# EAGLE design avr (EAGLE 5.06)
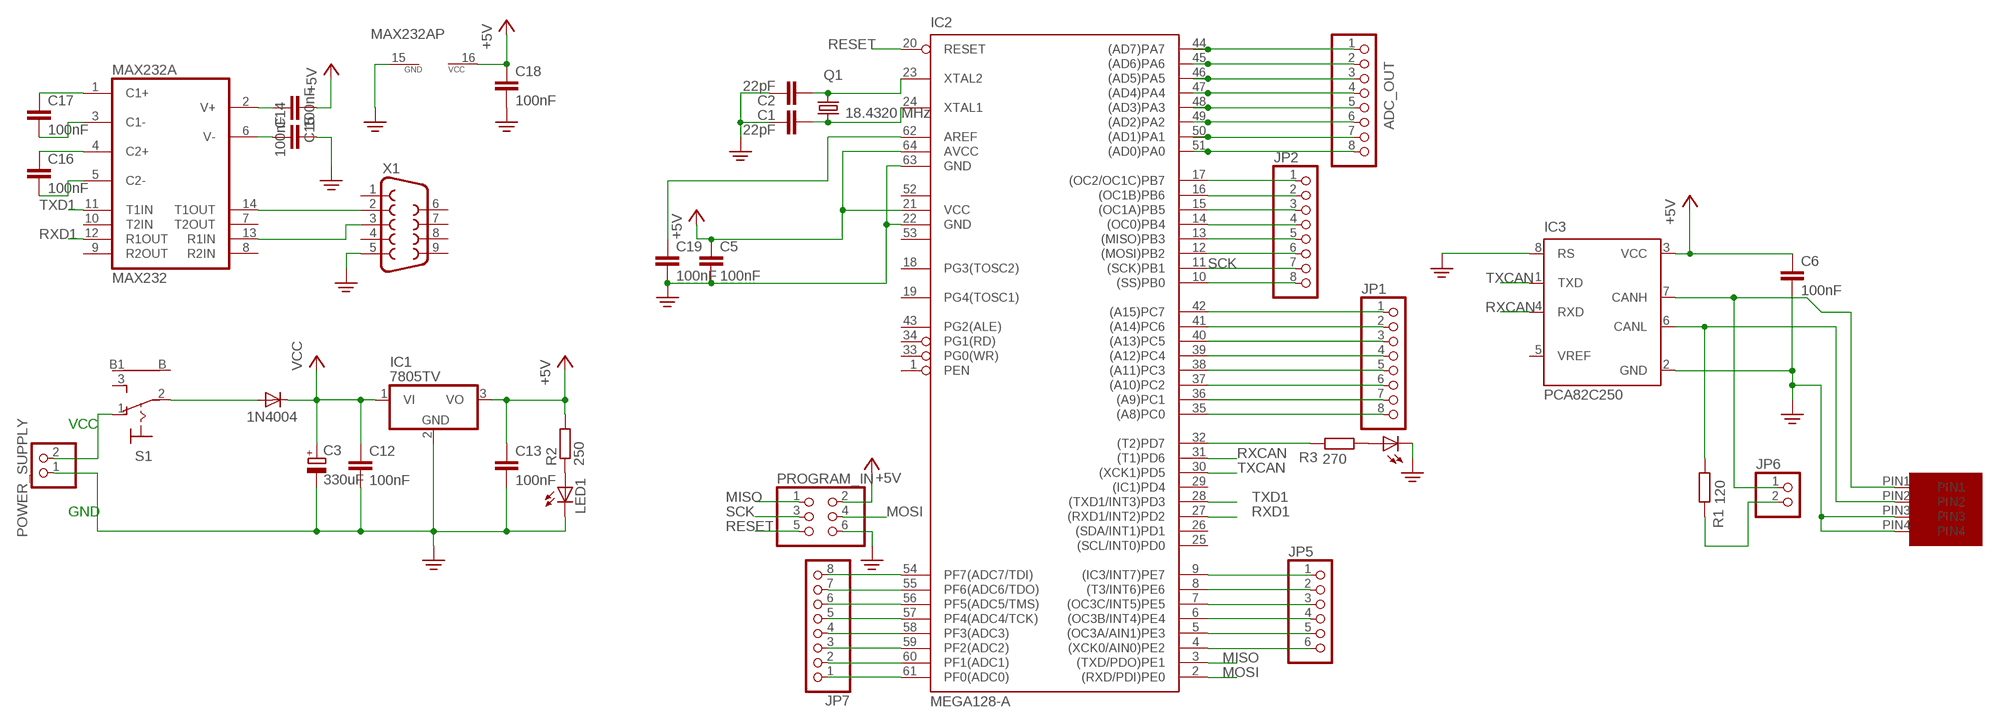
[diagram p0: schematic, sheet 1]

## Parts
ADC_OUT  PINHD-1X8  [1X08]
C1  22pF  C5/2.5  [C5B2.5]
C2  22pF  C5/2.5  [C5B2.5]
C3  330uF  CPOL-EUE15-5AXIAL  [E15-5]
C5  100nF  C-EU050-024X044  [C050-024X044]
C6  100nF  C-EU050-024X044  [C050-024X044]
C12  100nF  C-EU050-024X044  [C050-024X044]
C13  100nF  C-EU050-024X044  [C050-024X044]
C14  100nF  C-EU050-024X044  [C050-024X044]
C15  100nF  C-EU050-024X044  [C050-024X044]
C16  100nF  C-EU050-024X044  [C050-024X044]
C17  100nF  C-EU050-024X044  [C050-024X044]
C18  100nF  C-EU050-024X044  [C050-024X044]
C19  100nF  C-EU050-024X044  [C050-024X044]
D1  1N4004  [DO41-10]
IC1  7805TV  [TO220V]
IC2  MEGA128-A  [TQFP64]
IC3  PCA82C250  [DIL08]
JP1  PINHD-1X8  [1X08]
JP2  PINHD-1X8  [1X08]
JP5  PINHD-1X6  [1X06]
JP6  PINHD-1X2  [1X02]
JP7  PINHD-1X8  [1X08]
LED1  LED5MM  [LED5MM]
LED2  LED5MM  [LED5MM]
MAX232A  MAX232  [DIL16]
POWER_SUPPLY  PINHD-1X2  [1X02]
PROGRAM_IN  PINHD-2X3  [2X03]
Q1  18.4320 MHz  CRYSTALHC49U70  [HC49U70]
R1  120  R-EU_0207/10  [0207/10]
R2  250  R-EU_0207/10  [0207/10]
R3  270  R-EU_0207/10  [0207/10]
S1  LPV-1  [LPV-1]
U$1  MICROFIT4  [MICROFIT4SOCK]
X1  F09HP  [F09HP]

## Nets
+5V: C5.1 C6.1 C13.1 C15.1 C18.1 IC1.3(VO) IC2.21(VCC) IC2.64(AVCC) IC3.3(VCC) MAX232A.16(VCC) PROGRAM_IN.2 R2.2
MISO: IC2.3((TXD/PDO)PE1) PROGRAM_IN.1
MOSI: IC2.2((RXD/PDI)PE0) PROGRAM_IN.4
N$1: C1.2 IC2.24(XTAL1) Q1.1
N$2: C2.2 IC2.23(XTAL2) Q1.2
N$3: IC2.9((IC3/INT7)PE7) JP5.1
N$4: D1.A S1.2(P)
N$5: POWER_SUPPLY.2 S1.1(O)
N$6: LED1.A R2.1
N$7: IC2.35((A8)PC0) JP1.8
N$8: LED2.A R3.1
N$9: ADC_OUT.1 IC2.44((AD7)PA7)
N$10: C19.1 IC2.62(AREF)
N$11: ADC_OUT.2 IC2.45((AD6)PA6)
N$12: ADC_OUT.3 IC2.46((AD5)PA5)
N$13: ADC_OUT.4 IC2.47((AD4)PA4)
N$14: ADC_OUT.5 IC2.48((AD3)PA3)
N$15: ADC_OUT.6 IC2.49((AD2)PA2)
N$16: ADC_OUT.7 IC2.50((AD1)PA1)
N$17: ADC_OUT.8 IC2.51((AD0)PA0)
N$18: IC2.16((OC1B)PB6) JP2.2
N$19: IC2.17((OC2/OC1C)PB7) JP2.1
N$20: IC2.54(PF7(ADC7/TDI)) JP7.8
N$21: MAX232A.13(R1IN) X1.3
N$22: IC2.13((MISO)PB3) JP2.5
N$23: IC2.36((A9)PC1) JP1.7
N$24: IC2.37((A10)PC2) JP1.6
N$25: IC2.38((A11)PC3) JP1.5
N$26: IC2.39((A12)PC4) JP1.4
N$27: IC2.40((A13)PC5) JP1.3
N$28: IC2.41((A14)PC6) JP1.2
N$29: IC2.42((A15)PC7) JP1.1
N$30: IC2.8((T3/INT6)PE6) JP5.2
N$31: IC2.7((OC3C/INT5)PE5) JP5.3
N$32: IC2.6((OC3B/INT4)PE4) JP5.4
N$33: MAX232A.14(T1OUT) X1.2
N$34: IC2.5((OC3A/AIN1)PE3) JP5.5
N$35: C17.1 MAX232A.1(C1+)
N$36: C17.2 MAX232A.3(C1-)
N$37: C16.1 MAX232A.4(C2+)
N$38: C16.2 MAX232A.5(C2-)
N$39: C14.1 MAX232A.6(V-)
N$40: IC2.14((OC0)PB4) JP2.4
N$41: C15.2 MAX232A.2(V+)
N$42: IC2.4((XCK0/AIN0)PE2) JP5.6
N$43: IC2.32((T2)PD7) R3.2
N$44: IC2.55(PF6(ADC6/TDO)) JP7.7
N$45: IC2.10((SS)PB0) JP2.8
N$46: IC2.15((OC1A)PB5) JP2.3
N$47: IC2.12((MOSI)PB2) JP2.6
N$48: IC2.56(PF5(ADC5/TMS)) JP7.6
N$49: IC2.57(PF4(ADC4/TCK)) JP7.5
N$50: JP6.2 R1.2
N$51: IC3.6(CANL) R1.1 U$1.PIN2
N$52: IC3.7(CANH) JP6.1 U$1.PIN1
N$53: IC2.58(PF3(ADC3)) JP7.4
N$54: IC2.59(PF2(ADC2)) JP7.3
N$55: IC2.60(PF1(ADC1)) JP7.2
N$56: IC2.61(PF0(ADC0)) JP7.1
PE: C1.1 C2.1 C3.- C5.2 C6.2 C12.2 C13.2 C14.2 C18.2 C19.2 IC1.2(GND) IC2.22(GND) IC2.63(GND) IC3.2(GND) IC3.8(RS) LED1.K(C) LED2.K(C) MAX232A.15(GND) POWER_SUPPLY.1 PROGRAM_IN.6 U$1.PIN3 U$1.PIN4 X1.5
RESET: IC2.20(RESET) PROGRAM_IN.5
RXCAN: IC2.31((T1)PD6) IC3.4(RXD)
RXD1: IC2.27((RXD1/INT2)PD2) MAX232A.12(R1OUT)
SCK: IC2.11((SCK)PB1) JP2.7 PROGRAM_IN.3
TXCAN: IC2.30((XCK1)PD5) IC3.1(TXD)
TXD1: IC2.28((TXD1/INT3)PD3) MAX232A.11(T1IN)
VCC: C3.+ C12.1 D1.C IC1.1(VI)
Unconnected: IC2.1(PEN) IC2.18(PG3(TOSC2)) IC2.19(PG4(TOSC1)) IC2.25((SCL/INT0)PD0) IC2.26((SDA/INT1)PD1) IC2.29((IC1)PD4) IC2.33(PG0(WR)) IC2.34(PG1(RD)) IC2.43(PG2(ALE)) IC3.5(VREF) MAX232A.7(T2OUT) MAX232A.8(R2IN) MAX232A.9(R2OUT) MAX232A.10(T2IN) S1.3(S) S1.B S1.B1 X1.1 X1.4 X1.6 X1.7 X1.8 X1.9

## Notes on the sheet
- VCC
- GND

## Power pins joined to a net without a drawn wire
GND1: IC2.53(GND1)
VCC1: IC2.52(VCC1)

## Library data of the parts
ADC_OUT JP1 JP2 JP7 = pinhead:PINHD-1X8: PIN HEADER
C1 C2 = capacitor-wima:C: CAPACITOR naming: grid - package width
C3 = rcl:CPOL-EU: POLARIZED CAPACITOR, European symbol
C5 C6 C12-C19 = rcl:C-EU: CAPACITOR, European symbol
D1 = diode:1N4004: DIODE general purpose rectifier, 1 A
IC1 = linear:78*: Positive VOLTAGE REGULATOR Source: http://cache.national.com/ds/LM/LM78L05.pdf http://www.fairchildsemi.com/ds/LM/LM7805.pdf
IC2 = atmel:MEGA128: MICROCONTROLLER 128 Kbytes FLASH 4 Kbytes SRAM 4 Kbytes EEPROM DUAL USART 8-channel 10 bit ADC Source: avr.lbr
IC3 = micro-philips:PCA82C250: CAN CONTROLLER INTERFACE
JP5 = pinhead:PINHD-1X6: PIN HEADER
JP6 POWER_SUPPLY = pinhead:PINHD-1X2: PIN HEADER
LED1 LED2 = led:LED: LED OSRAM: - CHIPLED LG R971, LG N971, LY N971, LG Q971, LY Q971, LO R971, LY R971 LH N974, LH R974 LS Q976, LO Q976, LY Q976 LO Q996 - Hyper CHIPLED LW Q18S LB Q993, LB Q99A, LB R99A - SideLED LS A670, LO A670, LY A670, LG A670, LP A670 LB A673, LV A673, LT A673, LW A673 LH A674 LY A675 LS A676, LA A676, LO A676, LY A676, LW A676 LS A679, LY A679, LG A679 - Hyper Micro SIDELED® LS Y876, LA Y876, LO Y876, LY Y876 LT Y87S - SmartLED LW L88C, LW L88S LB L89C, LB L89S, LG L890 LS L89K, LO L89K, LY L89K LS L896, LA L896, LO L896, LY L896 - TOPLED LS T670, LO T670, LY T670, LG T670, LP T670 LSG T670, LSP T670, LSY T670, LOP T670, LYG T670 LG T671, LOG T671, LSG T671 LB T673, LV T673, LT T673, LW T673 LH T674 LS T676, LA T676, LO T676, LY T676, LB T676, LH T676, LSB T676, LW T676 LB T67C, LV T67C, LT T67C, LS T67K, LO T67K, LY T67K, LW E67C LS E67B, LA E67B, LO E67B, LY E67B, LB E67C, LV E67C, LT E67C LW T67C LS T679, LY T679, LG T679 LS T770, LO T770, LY T770, LG T770, LP T770 LB T773, LV T773, LT T773, LW T773 LH T774 LS E675, LA E675, LY E675, LS T675 LS T776, LA T776, LO T776, LY T776, LB T776 LHGB T686 LT T68C, LB T68C - Hyper Mini TOPLED® LB M676 - Mini TOPLED Santana® LG M470 LS M47K, LO M47K, LY M47K Source: http://www.osram.convergy.de LUXEON: - LUMILED® LXK2-PW12-R00, LXK2-PW12-S00, LXK2-PW14-U00, LXK2-PW14-V00 LXK2-PM12-R00, LXK2-PM12-S00, LXK2-PM14-U00 LXK2-PE12-Q00, LXK2-PE12-R00, LXK2-PE12-S00, LXK2-PE14-T00, LXK2-PE14-U00 LXK2-PB12-K00, LXK2-PB12-L00, LXK2-PB12-M00, LXK2-PB14-N00, LXK2-PB14-P00, LXK2-PB14-Q00 LXK2-PR12-L00, LXK2-PR12-M00, LXK2-PR14-Q00, LXK2-PR14-R00 LXK2-PD12-Q00, LXK2-PD12-R00, LXK2-PD12-S00 LXK2-PH12-R00, LXK2-PH12-S00 LXK2-PL12-P00, LXK2-PL12-Q00, LXK2-PL12-R00 Source: www.luxeon.com KINGBRIGHT: KA-3528ASYC Source: www.kingbright.com
MAX232A = maxim:MAX232: RS232 TRANSEIVER
PROGRAM_IN = pinhead:PINHD-2X3: PIN HEADER
Q1 = crystal:CRYSTAL: CRYSTAL
R1-R3 = resistor:R-EU_: RESISTOR, European symbol
S1 = switch:LPV-1: TOGGLE SWITCH
U$1 = UNICORN:MICROFIT4
X1 = con-subd:F09: SUB-D

## Board
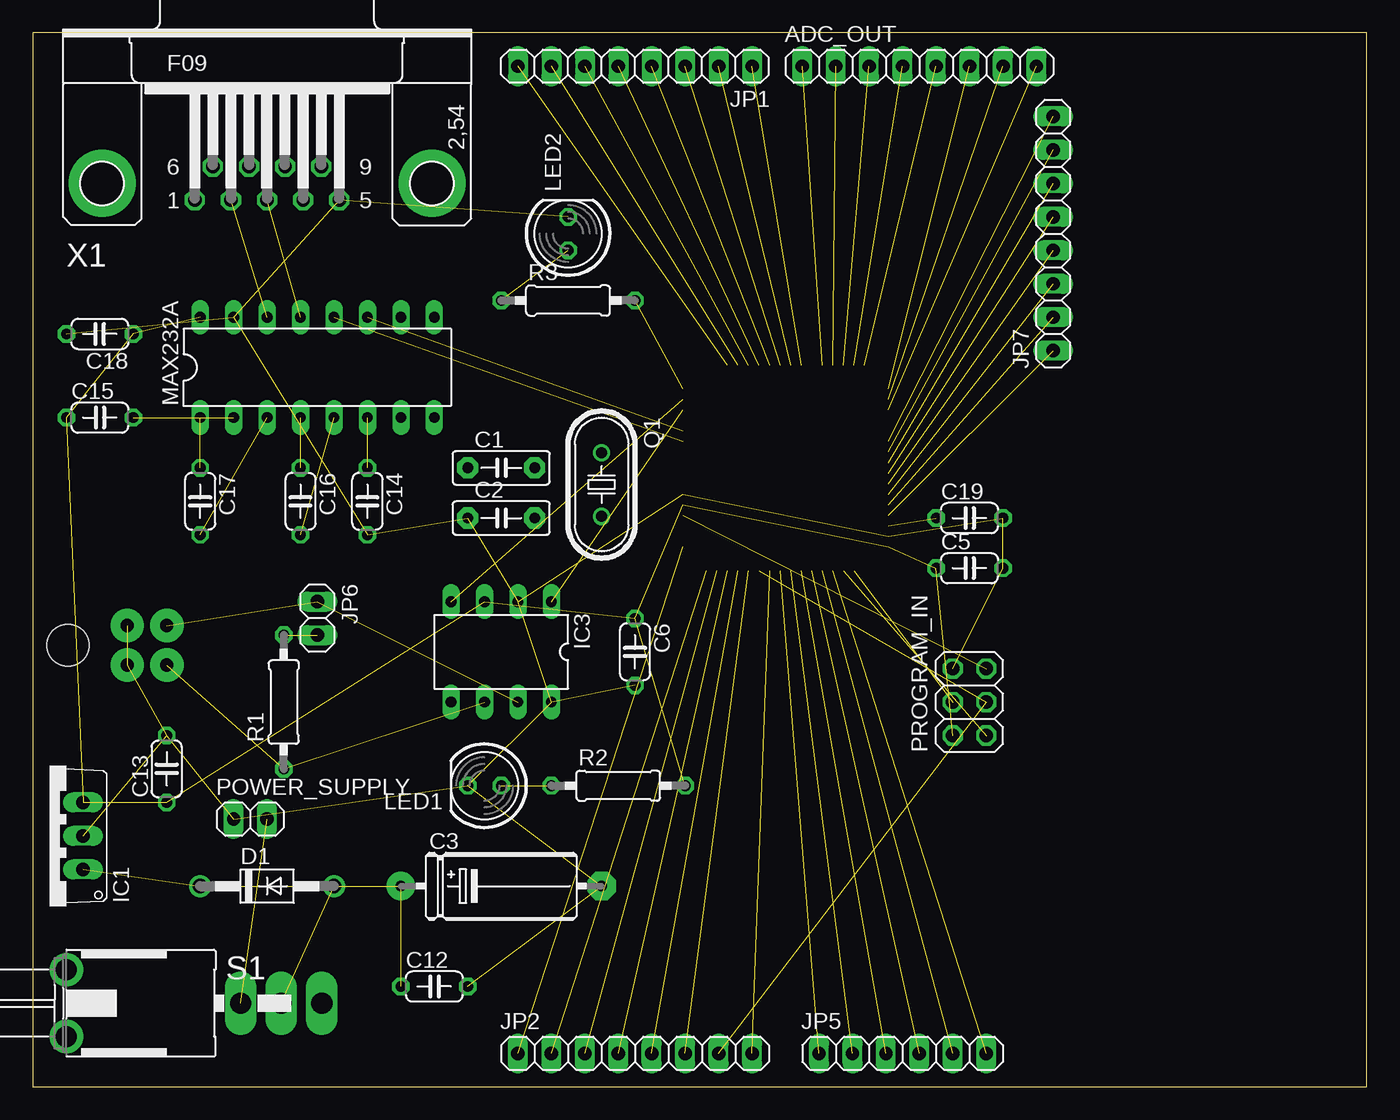
[diagram p1: board, top side]
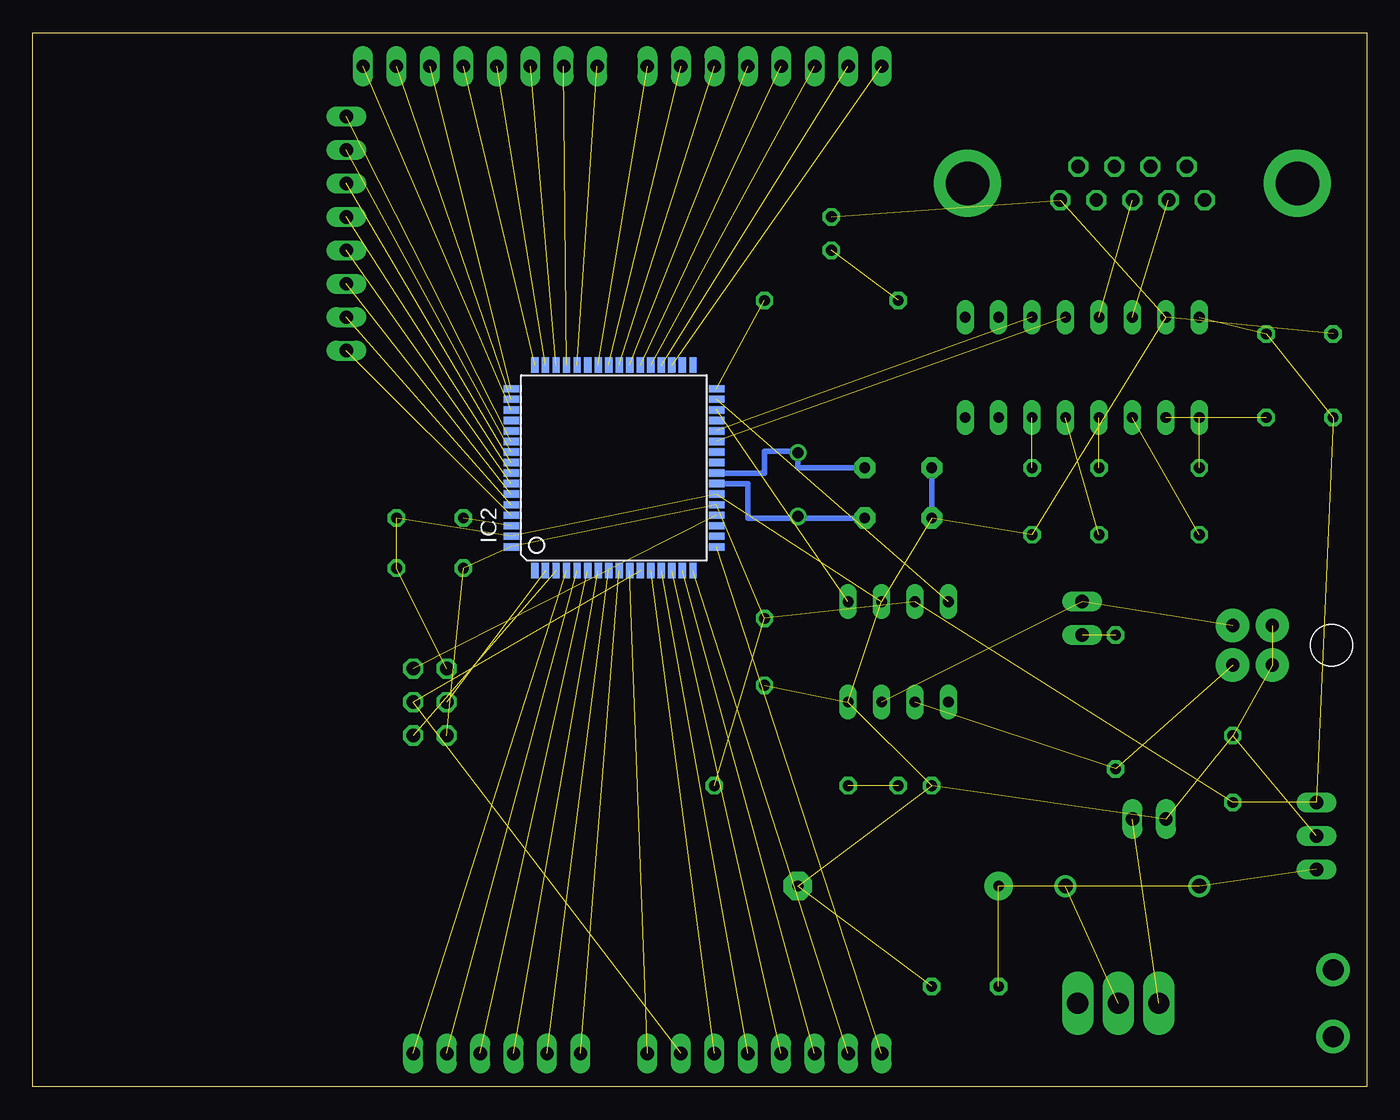
[diagram p2: board, bottom side, seen from below]

Size 101.27 x 80 mm. Coordinates in mm from the lower left corner, seen from the top.
Outline: 0,0 101.27,0 101.27,80 0,80 0,0
Copper layers (1*16): Top 0.035mm / dielectric 1.5mm / Bottom 0.035mm
Design rules "default": minimum track width 10mil, minimum drill 24mil, track to track 8mil, track to pad 8mil, pad to pad 8mil, via to via 8mil, smd to smd 8mil, copper to edge 40mil, drill to drill 8mil, minimum pad ring 10mil, minimum via ring 8mil, stop-mask expansion 4mil, vias tented up to drill 0mil, thermal gap 10mil
tRestrict: area 1.3,55.9 to 3.8,58.4; area 6.3,55.9 to 8.9,58.4; area 1.3,49.5 to 3.8,52.1; area 6.3,49.5 to 8.9,52.1; area 11.4,57.2 to 31.8,59.7; area 11.4,49.5 to 31.8,52.1; area 11.4,45.7 to 14,48.3; area 11.4,40.6 to 14,43.2; area 19.1,45.7 to 21.6,48.3; area 19.1,40.6 to 21.6,43.2; area 24.1,45.7 to 26.7,48.3; area 24.1,40.6 to 26.7,43.2; 47 more areas
vRestrict: area 48.3,38.1 to 66,55.9

### Footprints (pad centres in the part's own frame; a part is rotated, then mirrored left to right if it is on the bottom)
1X08 = drill 1.016 long: 1 -8.89,0; 2 -6.35,0; 3 -3.81,0; 4 -1.27,0; 5 1.27,0; 6 3.81,0; 7 6.35,0; 8 8.89,0
C5B2.5 = drill 0.813 pad 1.6 octagon: 1 -2.54,0; 2 2.54,0
E15-5 = drill 0.813 pad 2.159 round: + -7.62,0 | drill 0.813 pad 2.159 octagon: - 7.62,0
C050-024X044 = drill 0.813 octagon: 1 -2.54,0; 2 2.54,0
DO41-10 = drill 1.118 round: A 5.08,0; C -5.08,0
TO220V = drill 1.016 long: 1 -2.54,-2.54; 2 0,-2.54; 3 2.54,-2.54
TQFP64 = smd 1.194 x 0.559: 1 -7.8,6; 2 -7.8,5.2; 3 -7.8,4.4; 4 -7.8,3.6; 5 -7.8,2.8; 6 -7.8,2; 7 -7.8,1.2; 8 -7.8,0.4; 9 -7.8,-0.4; 10 -7.8,-1.2; 11 -7.8,-2; 12 -7.8,-2.8; 13 -7.8,-3.6; 14 -7.8,-4.4; 15 -7.8,-5.2; 16 -7.8,-6; 33 7.8,-6; 34 7.8,-5.2; 35 7.8,-4.4; 36 7.8,-3.6; 37 7.8,-2.8; 38 7.8,-2; 39 7.8,-1.2; 40 7.8,-0.4; 41 7.8,0.4; 42 7.8,1.2; 43 7.8,2; 44 7.8,2.8; 45 7.8,3.6; 46 7.8,4.4; 47 7.8,5.2; 48 7.8,6 | smd 0.559 x 1.194: 17 -6,-7.8; 18 -5.2,-7.8; 19 -4.4,-7.8; 20 -3.6,-7.8; 21 -2.8,-7.8; 22 -2,-7.8; 23 -1.2,-7.8; 24 -0.4,-7.8; 25 0.4,-7.8; 26 1.2,-7.8; 27 2,-7.8; 28 2.8,-7.8; 29 3.6,-7.8; 30 4.4,-7.8; 31 5.2,-7.8; 32 6,-7.8; 49 6,7.8; 50 5.2,7.8; 51 4.4,7.8; 52 3.6,7.8; 53 2.8,7.8; 54 2,7.8; 55 1.2,7.8; 56 0.4,7.8; 57 -0.4,7.8; 58 -1.2,7.8; 59 -2,7.8; 60 -2.8,7.8; 61 -3.6,7.8; 62 -4.4,7.8; 63 -5.2,7.8; 64 -6,7.8
DIL08 = drill 0.813 long: 1 -3.81,-3.81; 2 -1.27,-3.81; 3 1.27,-3.81; 4 3.81,-3.81; 5 3.81,3.81; 6 1.27,3.81; 7 -1.27,3.81; 8 -3.81,3.81
1X06 = drill 1.016 long: 1 -6.35,0; 2 -3.81,0; 3 -1.27,0; 4 1.27,0; 5 3.81,0; 6 6.35,0
1X02 = drill 1.016 long: 1 -1.27,0; 2 1.27,0
LED5MM = drill 0.813 octagon: A -1.27,0; K 1.27,0
DIL16 = drill 0.813 long: 1 -8.89,-3.81; 2 -6.35,-3.81; 3 -3.81,-3.81; 4 -1.27,-3.81; 5 1.27,-3.81; 6 3.81,-3.81; 7 6.35,-3.81; 8 8.89,-3.81; 9 8.89,3.81; 10 6.35,3.81; 11 3.81,3.81; 12 1.27,3.81; 13 -1.27,3.81; 14 -3.81,3.81; 15 -6.35,3.81; 16 -8.89,3.81
2X03 = drill 1.016 octagon: 1 -2.54,-1.27; 2 -2.54,1.27; 3 0,-1.27; 4 0,1.27; 5 2.54,-1.27; 6 2.54,1.27
HC49U70 = drill 0.813 round: 1 -2.413,0; 2 2.413,0
0207/10 = drill 0.813 octagon: 1 -5.08,0; 2 5.08,0
LPV-1 = drill 1.6 long: 1 0,13.24; 2 0,16.32; 3 0,19.4 | drill 1.6 pad 2.54 round: B -2.54,0; B1 2.54,0
MICROFIT4SOCK = drill 1 pad 2.54 round: PIN1 -2,0; PIN2 1,0; PIN3 -2,-3; PIN4 1,-3 | hole 3.2: -0.5,-7.5
F09HP = drill 1.016 octagon: 1 -5.486,-1.27; 2 -2.743,-1.27; 3 0,-1.27; 4 2.743,-1.27; 5 5.486,-1.27; 6 -4.115,1.27; 7 -1.372,1.27; 8 1.372,1.27; 9 4.115,1.27 | drill 3.302 pad 5.08 round: G1 -12.522,0; G2 12.522,0

### Placement (x,y rotation side)
ADC_OUT  67.31,77.47 0 top
C1  35.56,46.99 0 top
C2  35.56,43.18 0 top
C3  35.56,15.24 0 top
C5  71.12,39.37 0 top
C6  45.72,33.02 270 top
C12  30.48,7.62 0 top
C13  10.16,24.13 90 top
C14  25.4,44.45 270 top
C15  5.08,50.8 0 top
C16  20.32,44.45 270 top
C17  12.7,44.45 270 top
C18  5.08,57.15 180 top
C19  71.12,43.18 0 top
D1  17.78,15.24 0 top
IC1  1.27,19.05 90 top
IC2  57.15,46.99 90 bottom
IC3  35.56,33.02 180 top
JP1  45.72,77.47 180 top
JP2  45.72,2.54 0 top
JP5  66.04,2.54 0 top
JP6  21.59,35.56 270 top
JP7  77.47,64.77 90 top
LED1  34.29,22.86 180 top
LED2  40.64,64.77 90 top
MAX232A  21.59,54.61 0 top
POWER_SUPPLY  16.51,20.32 0 top
PROGRAM_IN  71.12,29.21 90 top
Q1  43.18,45.72 270 top
R1  19.05,29.21 90 top
R2  44.45,22.86 0 top
R3  40.64,59.69 0 top
S1  2.54,6.35 270 top
U$1  10.16,33.02 270 top
X1  17.78,68.58 0 top

### Tracks (layer width: path | path; a pad name or v marks a point on that pad's centre or on a via)
+5V  (11 unrouted)
MISO  (1 unrouted)
MOSI  (1 unrouted)
N$1
  Bottom 0.406: IC2.24 45.72,46.59 45.72,48.26 43.18,48.26 | 43.18,48.26 Q1.1 43.18,48.26 | 43.18,48.26 43.18,46.99 C1.2
N$2
  Bottom 0.406: IC2.23 46.99,45.79 46.99,43.18 43.18,43.18 | 43.18,43.18 Q1.2 43.18,43.18 | C2.2 43.18,43.18
N$3  (1 unrouted)
N$4  (1 unrouted)
N$5  (1 unrouted)
N$6  (1 unrouted)
N$7  (1 unrouted)
N$8  (1 unrouted)
N$9  (1 unrouted)
N$10  (1 unrouted)
N$11  (1 unrouted)
N$12  (1 unrouted)
N$13  (1 unrouted)
N$14  (1 unrouted)
N$15  (1 unrouted)
N$16  (1 unrouted)
N$17  (1 unrouted)
N$18  (1 unrouted)
N$19  (1 unrouted)
N$20  (1 unrouted)
N$21  (1 unrouted)
N$22  (1 unrouted)
N$23  (1 unrouted)
N$24  (1 unrouted)
N$25  (1 unrouted)
N$26  (1 unrouted)
N$27  (1 unrouted)
N$28  (1 unrouted)
N$29  (1 unrouted)
N$30  (1 unrouted)
N$31  (1 unrouted)
N$32  (1 unrouted)
N$33  (1 unrouted)
N$34  (1 unrouted)
N$35  (1 unrouted)
N$36  (1 unrouted)
N$37  (1 unrouted)
N$38  (1 unrouted)
N$39  (1 unrouted)
N$40  (1 unrouted)
N$41  (1 unrouted)
N$42  (1 unrouted)
N$43  (1 unrouted)
N$44  (1 unrouted)
N$45  (1 unrouted)
N$46  (1 unrouted)
N$47  (1 unrouted)
N$48  (1 unrouted)
N$49  (1 unrouted)
N$50  (1 unrouted)
N$51  (2 unrouted)
N$52  (2 unrouted)
N$53  (1 unrouted)
N$54  (1 unrouted)
N$55  (1 unrouted)
N$56  (1 unrouted)
PE  (21 unrouted)
  Bottom 0.406: C2.1 C1.1
RESET  (1 unrouted)
RXCAN  (1 unrouted)
RXD1  (1 unrouted)
SCK  (2 unrouted)
TXCAN  (1 unrouted)
TXD1  (1 unrouted)
VCC  (3 unrouted)

### Text on the board
tRestrict: 1